# EAGLE design TargetBoardResistiveDivider (EAGLE 7.3.0)
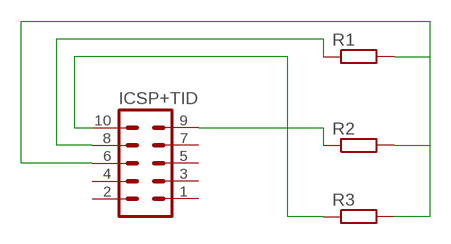
[diagram p0: schematic, sheet 1]

## Parts
ICSP+TID  MA05-2  [MA05-2]
R1  R-EU_R1206  [R1206]
R2  R-EU_R1206  [R1206]
R3  R-EU_R1206  [R1206]

## Nets
N$1: ICSP+TID.6 R1.2 R2.2 R3.2
N$2: ICSP+TID.8 R1.1
N$3: ICSP+TID.9 R2.1
N$4: ICSP+TID.10 R3.1
Unconnected: ICSP+TID.1 ICSP+TID.2 ICSP+TID.3 ICSP+TID.4 ICSP+TID.5 ICSP+TID.7

## Library data of the parts
ICSP+TID = con-lstb:MA05-2: PIN HEADER; OC_FARNELL: unknown; OC_NEWARK: unknown
R1-R3 = resistor:R-EU_: RESISTOR, European symbol

## Board
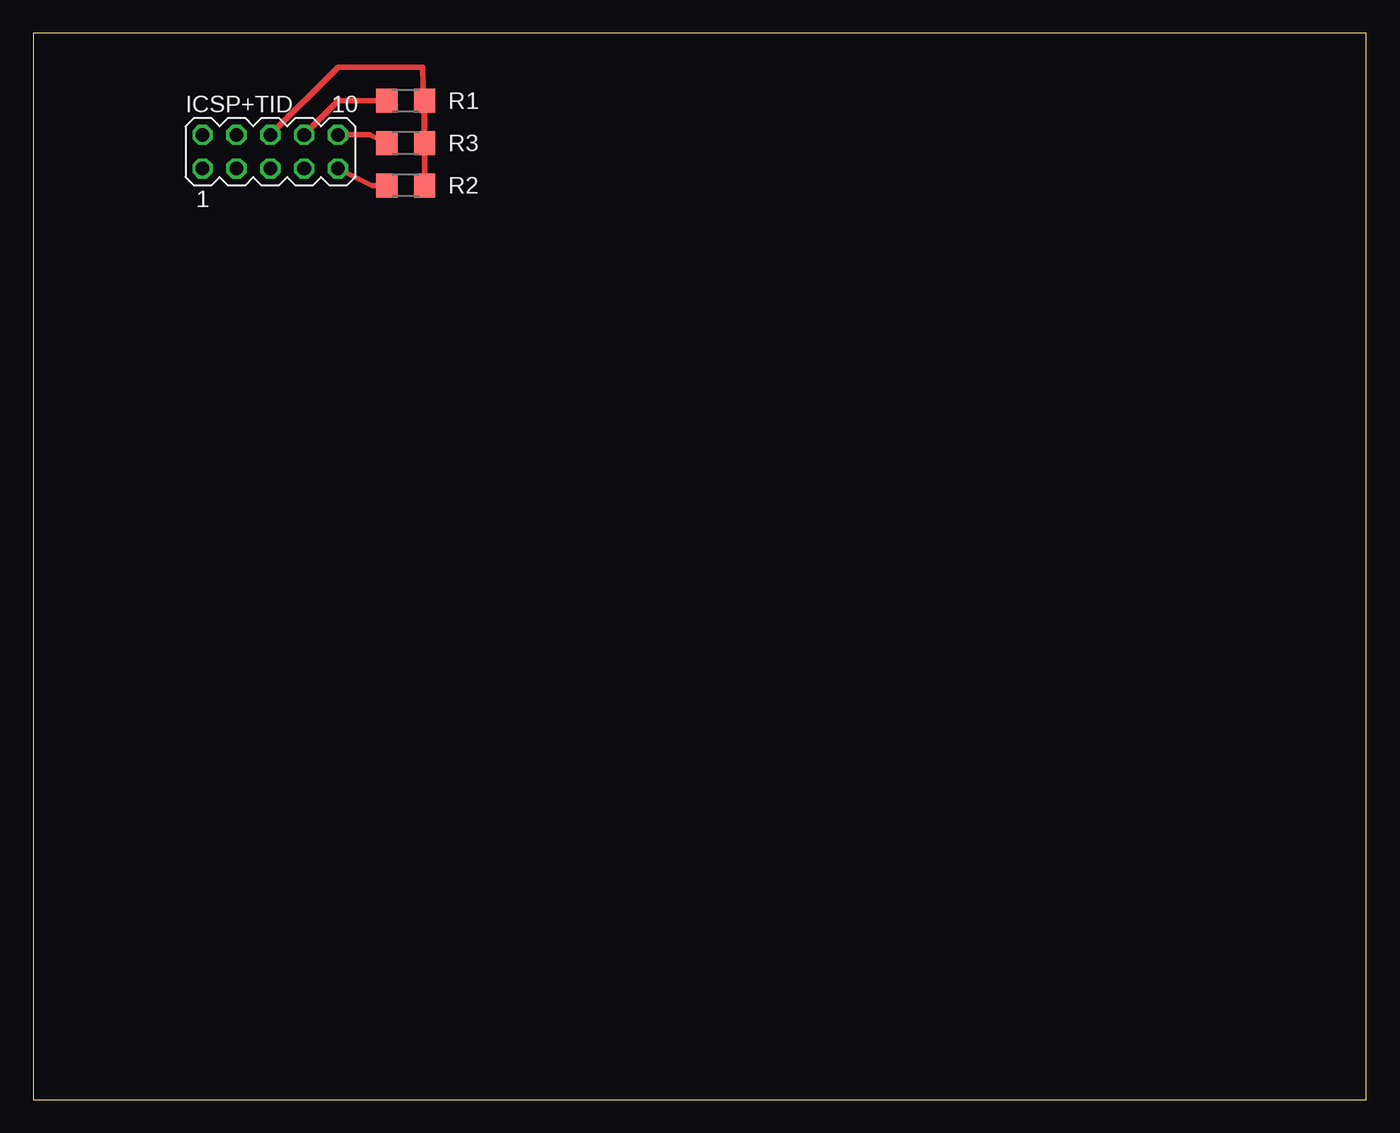
[diagram p1: board, top side]

Size 100 x 80 mm. Coordinates in mm from the lower left corner, seen from the top.
Outline: 0,0 100,0 100,80 0,80 0,0
Copper layers (1*16): Top 0.035mm / dielectric 1.5mm / Bottom 0.035mm
Design rules "default": minimum track width 10mil, minimum drill 24mil, track to track 8mil, track to pad 8mil, pad to pad 8mil, via to via 8mil, smd to smd 8mil, copper to edge 40mil, drill to drill 8mil, minimum pad ring 10mil, minimum via ring 8mil, stop-mask expansion 4mil, vias tented up to drill 0mil, thermal gap 10mil

### Footprints (pad centres in the part's own frame; a part is rotated, then mirrored left to right if it is on the bottom)
MA05-2 = drill 1.016 octagon: 1 -5.08,-1.27; 2 -5.08,1.27; 3 -2.54,-1.27; 4 -2.54,1.27; 5 0,-1.27; 6 0,1.27; 7 2.54,-1.27; 8 2.54,1.27; 9 5.08,-1.27; 10 5.08,1.27
R1206 = smd 1.6 x 1.803: 1 -1.422,0; 2 1.422,0

### Placement (x,y rotation side)
ICSP+TID  17.78,71.12 0 top
R1  27.94,74.93 0 top
R2  27.94,68.58 0 top
R3  27.94,71.75 0 top

### Tracks (layer width: path | path; a pad name or v marks a point on that pad's centre or on a via)
N$1
  Top 0.406: R2.2 R3.2 | R1.2 R3.2 | R3.2 29.21,77.47 22.86,77.47 ICSP+TID.6
N$2
  Top 0.406: ICSP+TID.8 22.86,74.93 R1.1
N$3
  Top 0.406: ICSP+TID.9 25.4,68.58 R2.1
N$4
  Top 0.406: ICSP+TID.10 25.25,72.39 R3.1